# EAGLE schematic untitled (EAGLE 5.10)
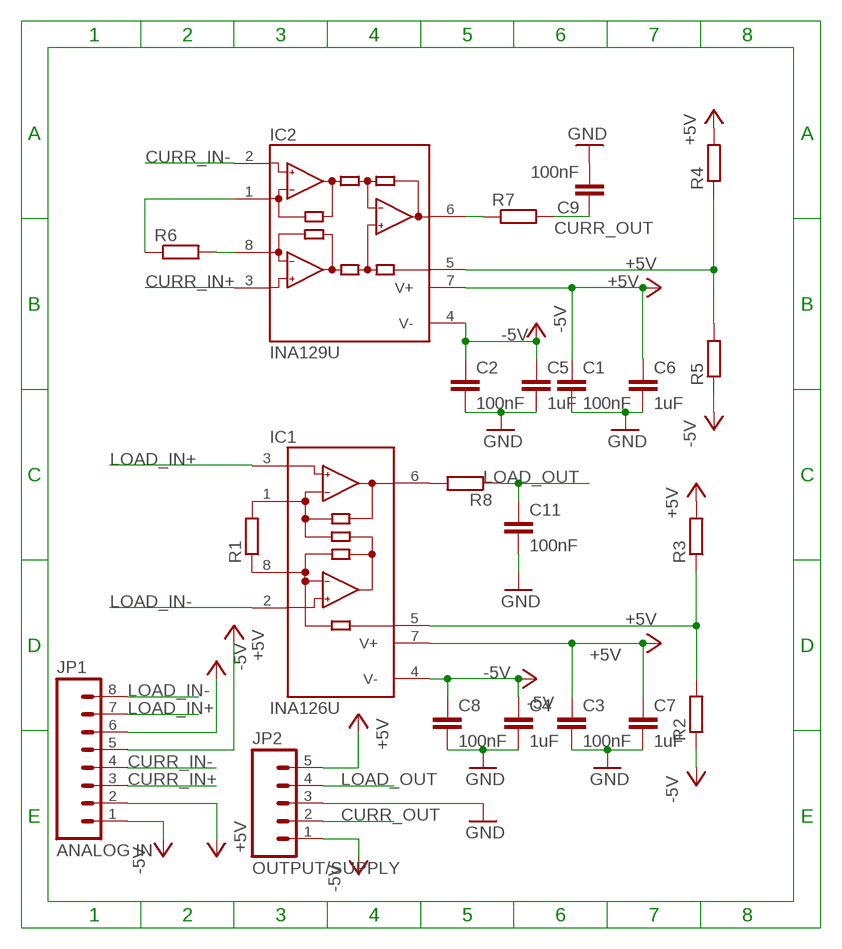
[diagram p0: schematic, sheet 1]

## Parts
C1  100nF  C-EUC0805  [C0805]
C2  100nF  C-EUC0805  [C0805]
C3  100nF  C-EUC0805  [C0805]
C4  1uF  C-EUC0805  [C0805]
C5  1uF  C-EUC1206  [C1206]
C6  1uF  C-EUC1206  [C1206]
C7  1uF  C-EUC1206  [C1206]
C8  100nF  C-EUC1206  [C1206]
C9  100nF  C-EUC0805  [C0805]
C11  100nF  C-EUC0805  [C0805]
IC1  INA126U  [SO08]
IC2  INA129U  [SO08]
JP1  ANALOG IN  M08LONGPADS  [1X08_LONGPADS]
JP2  OUTPUT/SUPPLY  M05PTH_LONGPADS  [1X05_LONGPADS]
R1  R-EU_M0805  [M0805]
R2  R-EU_M0805  [M0805]
R3  R-EU_M0805  [M0805]
R4  R-EU_M0805  [M0805]
R5  R-EU_M0805  [M0805]
R6  R-EU_M0805  [M0805]
R7  R-EU_M0805  [M0805]
R8  R-EU_M0805  [M0805]

## Nets
+5V: C1.1 C3.1 C6.1 C7.1 IC1.7(V+) IC2.7(V+) JP1.2 JP1.5 JP2.5 R3.2 R4.2
-5V: C2.1 C4.1 C5.1 C8.1 IC1.4(V-) IC2.4(V-) JP1.1 JP1.6 JP2.1 R2.1 R5.1
CURR_IN+: IC2.3(+IN) JP1.3
CURR_IN-: IC2.2(-IN) JP1.4
CURR_OUT: C9.1 JP2.2 R7.2
GND: C1.2 C2.2 C3.2 C4.2 C5.2 C6.2 C7.2 C8.2 C9.2 C11.2 JP2.3
LOAD_IN+: IC1.3(+IN) JP1.7
LOAD_IN-: IC1.2(-IN) JP1.8
LOAD_OUT: C11.1 JP2.4 R8.1
N$1: IC1.1(RG) R1.2
N$2: IC1.8(RG) R1.1
N$3: IC2.8(RG) R6.2
N$4: IC2.1(RG) R6.1
N$7: IC2.6(OUT) R7.1
N$8: IC1.6(OUT) R8.2
N$11: IC2.5(REF) R4.1 R5.2
N$15: IC1.5(REF) R2.2 R3.1

## Library data of the parts
C1-C9 C11 = rcl:C-EU: CAPACITOR, European symbol
IC1 = burr-brown:INA126: Instrumentation Amplifier Micropower, Single and Dual Versions
IC2 = burr-brown:INA129: Instrumentation Amplifiers Precision, Low Power
JP1 = SparkFun:M08: Header 8 Standard 8-pin 0.1" header. Use with straight break away headers (SKU : PRT-00116), right angle break away headers (PRT-00553), swiss pins (PRT-00743), machine pins (PRT-00117), and female headers (PRT-00115).
JP2 = SparkFun:M05: Header 5 Standard 5-pin 0.1" header. Use with straight break away headers (SKU : PRT-00116), right angle break away headers (PRT-00553), swiss pins (PRT-00743), machine pins (PRT-00117), and female headers (PRT-00115). Molex polarized connector foot print use with SKU : PRT-08230 with associated crimp pins and housings.
R1-R8 = rcl:R-EU_: RESISTOR, European symbol